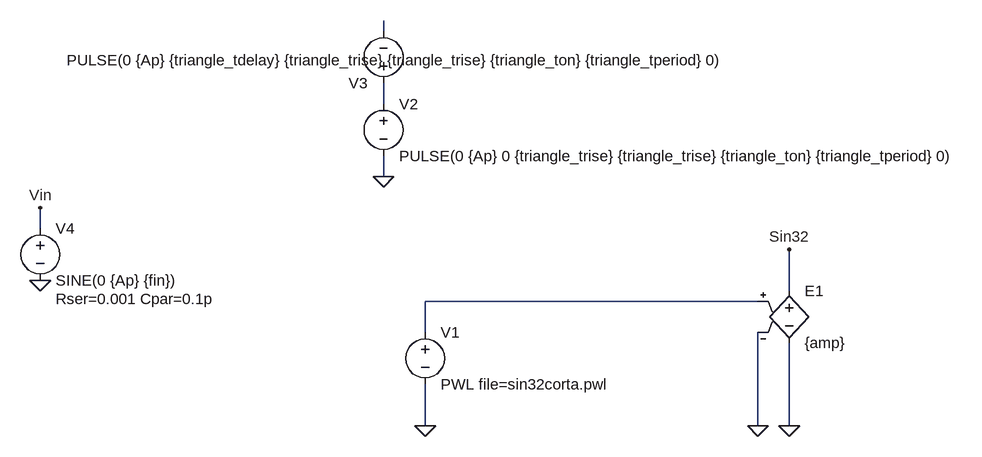
[diagram p0: schematic OTRAS SEÑALES.asc]
OTRAS SEÑALES.asc, the LTspice schematic file:
Version 4
SHEET 1 1240 680
WIRE 224 -160 224 -176
WIRE 224 -48 224 -80
WIRE 224 64 224 32
WIRE -304 144 -304 112
WIRE 848 240 848 176
WIRE 800 256 288 256
WIRE 288 304 288 256
WIRE 288 448 288 384
WIRE 800 448 800 304
WIRE 848 448 848 320
FLAG 288 448 0
FLAG 224 64 0
FLAG -304 224 0
FLAG -304 112 Vin
FLAG 800 448 0
FLAG 848 448 0
FLAG 848 176 Sin32
SYMBOL voltage 288 288 R0
WINDOW 123 0 0 Left 0
WINDOW 39 0 0 Left 0
SYMATTR InstName V1
SYMATTR Value PWL file=sin32corta.pwl
SYMBOL voltage 224 -64 R0
WINDOW 123 0 0 Left 0
WINDOW 39 0 0 Left 0
SYMATTR InstName V2
SYMATTR Value PULSE(0 {Ap} 0 {triangle_trise} {triangle_trise} {triangle_ton} {triangle_tperiod} 0)
SYMBOL voltage 224 -64 R180
WINDOW 3 -539 51 Left 2
WINDOW 123 0 0 Left 0
WINDOW 39 0 0 Left 0
SYMATTR Value PULSE(0 {Ap} {triangle_tdelay} {triangle_trise} {triangle_trise} {triangle_ton} {triangle_tperiod} 0)
SYMATTR InstName V3
SYMBOL voltage -304 128 R0
WINDOW 123 0 0 Left 0
WINDOW 39 24 124 Left 2
SYMATTR SpiceLine Rser=0.001 Cpar=0.1p
SYMATTR InstName V4
SYMATTR Value SINE(0 {Ap} {fin})
SYMBOL e 848 224 R0
SYMATTR InstName E1
SYMATTR Value {amp}

The netlist it stands for:
* OTRAS SEÑALES.asc
V1 N003 0 PWL file=sin32corta.pwl
V2 N002 0 PULSE(0 {Ap} 0 {triangle_trise} {triangle_trise} {triangle_ton} {triangle_tperiod} 0)
V3 N002 N001 PULSE(0 {Ap} {triangle_tdelay} {triangle_trise} {triangle_trise} {triangle_ton} {triangle_tperiod} 0)
V4 Vin 0 SINE(0 {Ap} {fin}) Rser=0.001 Cpar=0.1p
E1 Sin32 0 N003 0 {amp}
.backanno
.end